# EasyEDA Pro project ProPrj_OpenCartGBA_2024-06-17.epro

# Schematic FRAM Save
Create Date: 2022-08-30; Page Name: P1; Project Name: OpenCartGBA; Schematic Name: FRAM Save; Update Date: 2022-09-11; Company: oshwhub.com/laqieer/opencartgba; Drawed: laqieer; Page Size: A4; Reviewed: laqieer; Version: 1
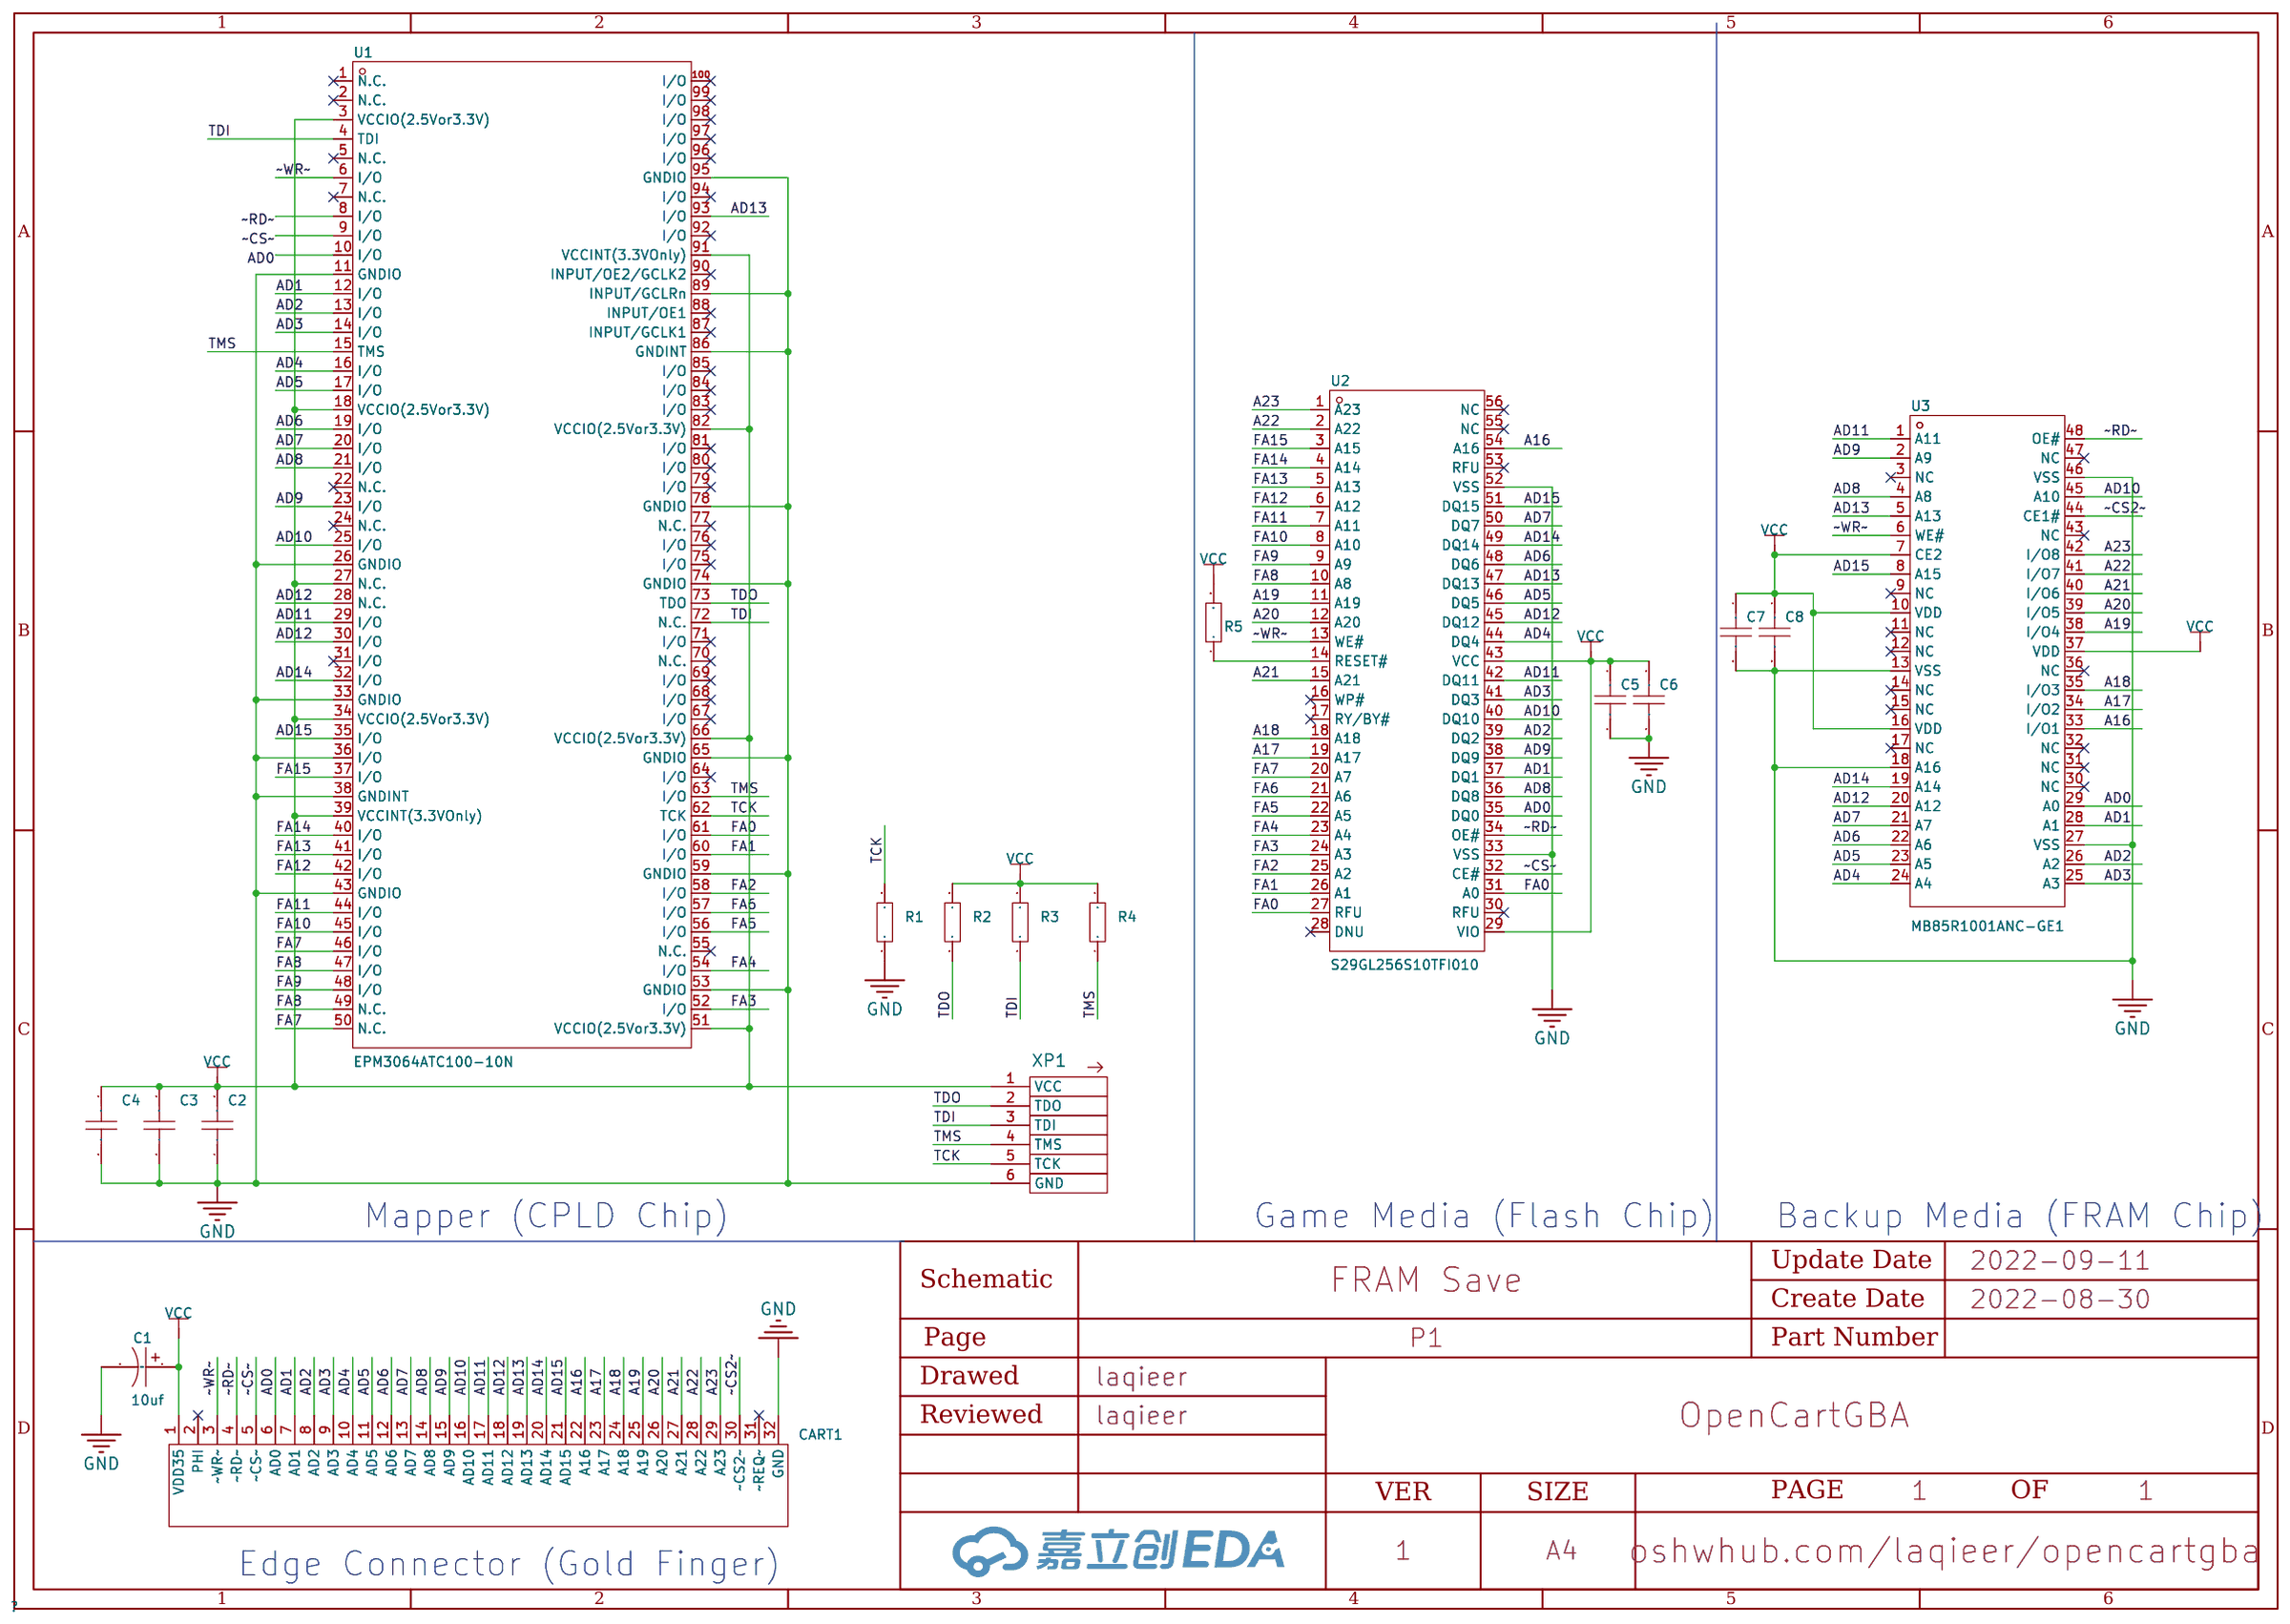
[diagram p0: schematic sheet]

## Parts
C1  10uf  [CAP-SMD_L2.0-W1.3-FD]
C2  100nF/0603/50V  [C0603]
C3  100nF/0603/50V  [C0603]
C4  100nF/0603/50V  [C0603]
C5  100nF/0603/50V  [C0603]
C6  100nF/0603/50V  [C0603]
C7  100nF/0603/50V  [C0603]
C8  100nF/0603/50V  [C0603]
CART1  -  [GBACartridge]  (no BOM)
R1  10kΩ  [R0603]
R2  10kΩ  [R0603]
R3  10kΩ  [R0603]
R4  10kΩ  [R0603]
R5  10kΩ  [R0603]
U1  EPM3064ATC100-10N  [TQFP-100_L14.0-W14.0-P0.50-LS16.0-BL]
U2  S29GL256S10TFI010  [TSOP-56_L18.4-W14.0-P0.50-LS20.0-TL]
U3  MB85R1001ANC-GE1  [TSOP-48_L12.4-W12.2-P0.50-LS14.0-BL]
XP1  JTAG  [JTAG_5P-P2.54]  (no BOM)

## Library data of the parts
C1 = 10uf: Supplier Part: C9900016685; Supplier Footprint: SMD,2x1.25x1.2mm; JLCPCB Part Class: Extended Part; Datasheet: https://atta.szlcsc.comnull; Supplier: LCSC
C2-C8 = 100nF/0603/50V: Supplier Part: C9900013340; JLCPCB Part Class: Extended Part; Datasheet: https://atta.szlcsc.comnull; Supplier: LCSC
CART1 = GBACartridge: GBA Cartridge
R1-R5 = 10kω: 电阻类型:薄膜电阻;阻值:10kΩ;精度:±0.1%;功率:100mW;温度系数:±25ppm/;最大工作电压:75V;工作温度范围:-55~+155;; LCSC Part Name: 10kΩ ±0.1% 100mW; Supplier Part: C188363; Manufacturer: EVER OHMS(天二科技); Manufacturer Part: TR0603B10K0P0525Z; Supplier Footprint: 0603; JLCPCB Part Class: Extended Part; Datasheet: https://atta.szlcsc.com/upload/public/pdf/source/20190415/C188363_433BF05B6FB8F7A0F5F35A3E4390C55A.pdf; Supplier: LCSC; Type: 薄膜电阻; Tolerance: ±0.1%; Power(Watts): 100mW; Temperature Coefficient: ±25ppm/; Overload Voltage (Max): 75V; Operating Temperature Range: -55~+155
U1 = EPM3064ATC100-10N: 可编程类型:-;逻辑元件/块数:-;宏单元数:-;I/O 数:-;工作温度:-;; Supplier Part: C34245; Manufacturer: Intel/Altera; Supplier Footprint: TQFP-100_14x14x05P; JLCPCB Part Class: Extended Part; Datasheet: https://atta.szlcsc.com/upload/public/pdf/source/20140723/1457707156998.pdf; Supplier: LCSC
U2 = S29GL256S10TFI010: Supplier Part: C1350995; Manufacturer: SPANSION(飞索); Supplier Footprint: TSOP-56; JLCPCB Part Class: Extended Part; Datasheet: https://atta.szlcsc.com/upload/public/pdf/source/20201109/C914940_4A5E28132C9BE0EE19A790F58F84C86D.pdf; Supplier: LCSC
U3 = MB85R1001ANC-GE1: 存储器容量:1Mb (128K x 8);存储器接口类型:Parallel;工作电压:3V ~ 3.6V;; Supplier Part: C126736; Manufacturer: FUJITSU(富士通); Supplier Footprint: TSOP-48; JLCPCB Part Class: Extended Part; Datasheet: https://atta.szlcsc.com/upload/public/pdf/source/20170821/C126736_1503303359319901614.pdf; Supplier: LCSC; Memory Format: FRAM; Memory Size: 1Mb (128K x 8); Memory Interface: Parallel; Voltage - Supply: 3V ~ 3.6V
XP1 = jtag

## Nets
GND: C1.2 C2.1 C3.2 C4.2 C5.2 C6.2 C7.2 C8.2 CART1.32(GND) R1.1 U1.11(GNDIO) U1.26(GNDIO) U1.33(GNDIO) U1.36(I/O) U1.38(GNDINT) U1.43(GNDIO) U1.53(GNDIO) U1.59(GNDIO) U1.65(GNDIO) U1.74(GNDIO) U1.78(GNDIO) U1.86(GNDINT) U1.89(INPUT/GCLRn) U1.95(GNDIO) U2.33(VSS) U2.52(VSS) U3.13(VSS) U3.18(A16) U3.27(VSS) U3.46(VSS) XP1.6(GND)
VCC: C1.1 C2.2 C3.1 C4.1 C5.1 C6.1 C7.1 C8.1 CART1.1(VDD35) R2.2 R3.2 R4.2 R5.2 U1.3(VCCIO(2.5Vor3.3V)) U1.18(VCCIO(2.5Vor3.3V)) U1.27(N.C.) U1.34(VCCIO(2.5Vor3.3V)) U1.39(VCCINT(3.3VOnly)) U1.51(VCCIO(2.5Vor3.3V)) U1.66(VCCIO(2.5Vor3.3V)) U1.82(VCCIO(2.5Vor3.3V)) U1.91(VCCINT(3.3VOnly)) U2.29(VIO) U2.43(VCC) U3.7(CE2) U3.10(VDD) U3.16(VDD) U3.37(VDD) XP1.1(VCC)
A16: CART1.22(A16) U2.54(A16) U3.33(I/O1)
A17: CART1.23(A17) U2.19(A17) U3.34(I/O2)
A18: CART1.24(A18) U2.18(A18) U3.35(I/O3)
A19: CART1.25(A19) U2.11(A19) U3.38(I/O4)
A20: CART1.26(A20) U2.12(A20) U3.39(I/O5)
A21: CART1.27(A21) U2.15(A21) U3.40(I/O6)
A22: CART1.28(A22) U2.2(A22) U3.41(I/O7)
A23: CART1.29(A23) U2.1(A23) U3.42(I/O8)
AD0: CART1.6(AD0) U1.10(I/O) U2.35(DQ0) U3.29(A0)
AD1: CART1.7(AD1) U1.12(I/O) U2.37(DQ1) U3.28(A1)
AD2: CART1.8(AD2) U1.13(I/O) U2.39(DQ2) U3.26(A2)
AD3: CART1.9(AD3) U1.14(I/O) U2.41(DQ3) U3.25(A3)
AD4: CART1.10(AD4) U1.16(I/O) U2.44(DQ4) U3.24(A4)
AD5: CART1.11(AD5) U1.17(I/O) U2.46(DQ5) U3.23(A5)
AD6: CART1.12(AD6) U1.19(I/O) U2.48(DQ6) U3.22(A6)
AD7: CART1.13(AD7) U1.20(I/O) U2.50(DQ7) U3.21(A7)
AD8: CART1.14(AD8) U1.21(I/O) U2.36(DQ8) U3.4(A8)
AD9: CART1.15(AD9) U1.23(I/O) U2.38(DQ9) U3.2(A9)
AD10: CART1.16(AD10) U1.25(I/O) U2.40(DQ10) U3.45(A10)
AD11: CART1.17(AD11) U1.29(I/O) U2.42(DQ11) U3.1(A11)
AD12: CART1.18(AD12) U1.28(N.C.) U1.30(I/O) U2.45(DQ12) U3.20(A12)
AD13: CART1.19(AD13) U1.93(I/O) U2.47(DQ13) U3.5(A13)
AD14: CART1.20(AD14) U1.32(I/O) U2.49(DQ14) U3.19(A14)
AD15: CART1.21(AD15) U1.35(I/O) U2.51(DQ15) U3.8(A15)
FA0: U1.61(I/O) U2.27(RFU) U2.31(A0)
FA1: U1.60(I/O) U2.26(A1)
FA2: U1.58(I/O) U2.25(A2)
FA3: U1.52(I/O) U2.24(A3)
FA4: U1.54(I/O) U2.23(A4)
FA5: U1.56(I/O) U2.22(A5)
FA6: U1.57(I/O) U2.21(A6)
FA7: U1.46(I/O) U1.50(N.C.) U2.20(A7)
FA8: U1.47(I/O) U1.49(N.C.) U2.10(A8)
FA9: U1.48(I/O) U2.9(A9)
FA10: U1.45(I/O) U2.8(A10)
FA11: U1.44(I/O) U2.7(A11)
FA12: U1.42(I/O) U2.6(A12)
FA13: U1.41(I/O) U2.5(A13)
FA14: U1.40(I/O) U2.4(A14)
FA15: U1.37(I/O) U2.3(A15)
TCK: R1.2 U1.62(TCK) XP1.5(TCK)
TDI: R3.1 U1.4(TDI) U1.72(N.C.) XP1.3(TDI)
TDO: R2.1 U1.73(TDO) XP1.2(TDO)
TMS: R4.1 U1.15(TMS) U1.63(I/O) XP1.4(TMS)
~CS2~: CART1.30(~CS2~) U3.44(CE1#)
~CS~: CART1.5(~CS~) U1.9(I/O) U2.32(CE#)
~RD~: CART1.4(~RD~) U1.8(I/O) U2.34(OE#) U3.48(OE#)
~WR~: CART1.3(~WR~) U1.6(I/O) U2.13(WE#) U3.6(WE#)
$1N60766: R5.1 U2.14(RESET#)

Not connected (* = marked no-connect by the designer): CART1 2(PHI)* 31(~REQ~)*; U1 1(N.C.)* 2(N.C.)* 5(N.C.)* 7(N.C.)* 22(N.C.)* 24(N.C.)* 31(I/O)* 55(N.C.)* 64(I/O)* 67(I/O)* 68(I/O)* 69(I/O)* 70(N.C.)* 71(I/O)* 75(I/O)* 76(I/O)* 77(N.C.)* 79(I/O)* 80(I/O)* 81(I/O)* 83(I/O)* 84(I/O)* 85(I/O)* 87(INPUT/GCLK1)* 88(INPUT/OE1)* 90(INPUT/OE2/GCLK2)* 92(I/O)* 94(I/O)* 96(I/O)* 97(I/O)* 98(I/O)* 99(I/O)* 100(I/O)*; U2 16(WP#)* 17(RY/BY#)* 28(DNU)* 30(RFU)* 53(RFU)* 55(NC)* 56(NC)*; U3 3(NC)* 9(NC)* 11(NC)* 12(NC)* 14(NC)* 15(NC)* 17(NC)* 30(NC)* 31(NC)* 32(NC)* 36(NC)* 43(NC)* 47(NC)*

## Notes on the sheet
- Mapper (CPLD Chip)
- Game Media (Flash Chip)
- Backup Media (FRAM Chip)
- Edge Connector (Gold Finger)

# Board PCB1
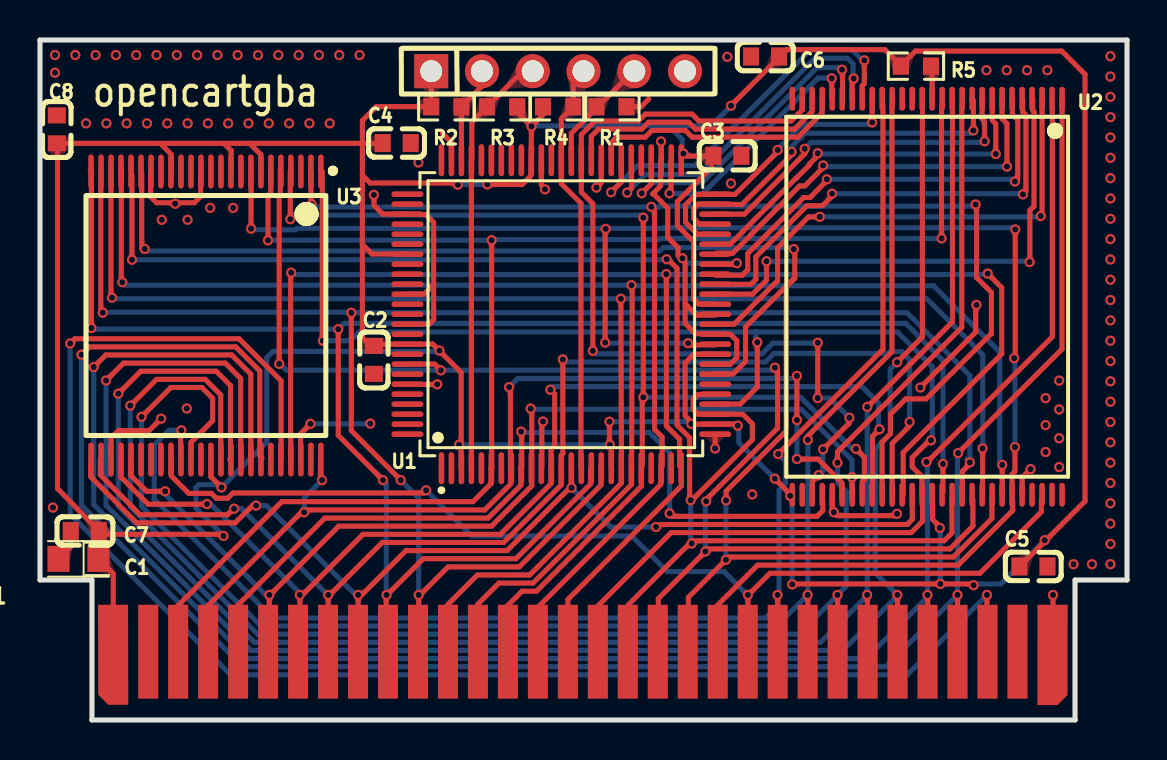
[diagram p1: board, top side]
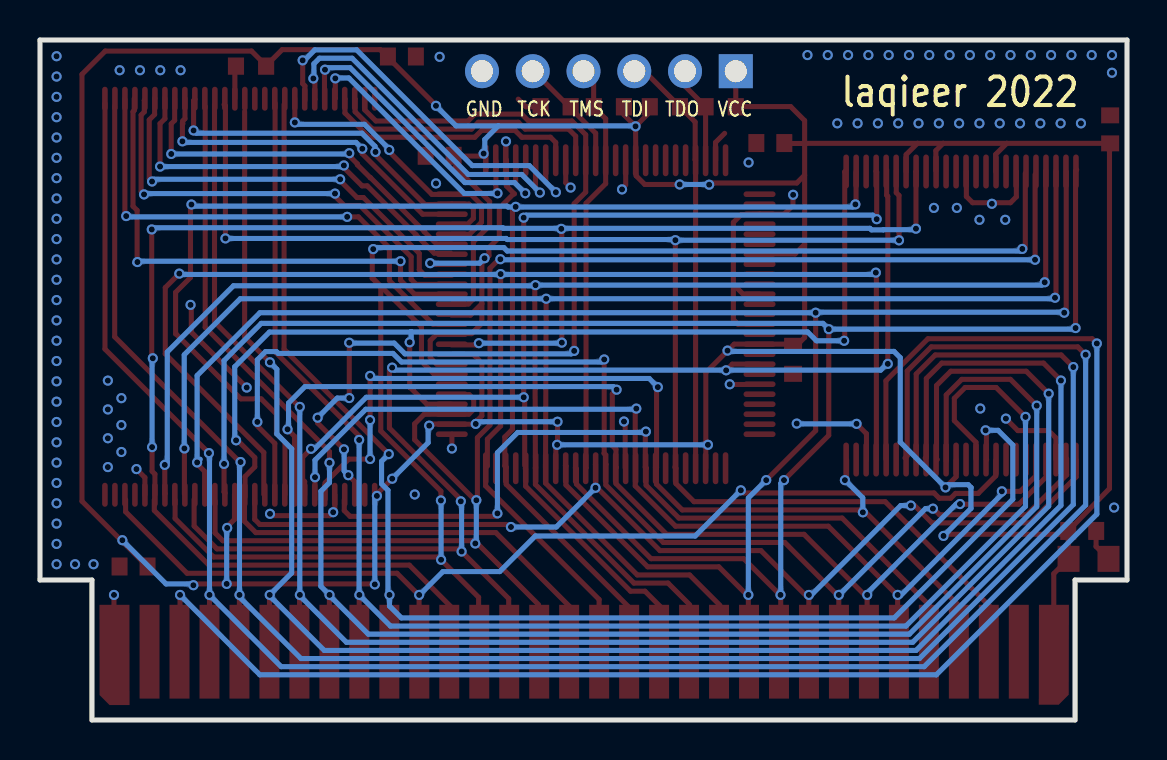
[diagram p2: board, bottom side, seen from below]

Outline 54.4 x 34 mm; copper layers: Top Layer, Bottom Layer. Coordinates in mm from the lower left corner of the outline.
Outline path: 0,34 0,7 2.6,7 2.6,0 51.8,0 51.8,7 54.4,7 54.4,34 0,34
Stack: Top Layer 0.035mm / Dielectric1 0.71mm FR4 er 4.5 / Bottom Layer 0.035mm

## Design rules (mm)
spacing safeClearance (default): track to track 0.152, other pairs 0 to 0.305
track width trackWidth (default): min 0.127, default 0.254, max 2.54
differential pair differentialPair (default): width min 0.127, default 0.254, max 2.54; gap min 0.152, default 0.152
via viaSize (default): diameter min 0.5, default 0.61, max 10; hole min 0.3, default 0.305, max 6

## Placement (name value [footprint] x y rotation side)
C1  10uf  [CAP-SMD_L2.0-W1.3-FD]  1.93 8.06 180 top
C2  100nF/0603/50V  [C0603]  16.71 18.01 90 top
C3  100nF/0603/50V  [C0603]  34.4 28.21 0 top
C4  100nF/0603/50V  [C0603]  17.85 28.85 0 top
C5  100nF/0603/50V  [C0603]  49.72 7.67 0 top
C6  100nF/0603/50V  [C0603]  36.29 33.17 180 top
C7  100nF/0603/50V  [C0603]  2.24 9.45 180 top
C8  100nF/0603/50V  [C0603]  0.84 29.53 90 top
CART1  -  [GBACartridge]  27.14 18.22 0 top
R1  10kΩ  [R0603]  28.6 30.66 180 top
R2  10kΩ  [R0603]  20.33 30.66 180 top
R3  10kΩ  [R0603]  23.13 30.66 0 top
R4  10kΩ  [R0603]  25.93 30.66 180 top
R5  10kΩ  [R0603]  43.84 32.69 180 top
U1  EPM3064ATC100-10N  [TQFP-100_L14.0-W14.0-P0.50-LS16.0-BL]  26.09 20.29 0 top
U2  S29GL256S10TFI010  [TSOP-56_L18.4-W14.0-P0.50-LS20.0-TL]  44.4 21.16 270 top
U3  MB85R1001ANC-GE1  [TSOP-48_L12.4-W12.2-P0.50-LS14.0-BL]  8.31 20.22 180 top
XP1  JTAG  [JTAG_5P-P2.54]  24.66 32.44 0 top

## Footprints (pads in the part's own frame, mm; a bottom-side part is the same pattern mirrored in y, then rotated)
C0603
  rect 0.8x0.9 smd: 1(-0.7,0) 2(0.7,0)
CAP-SMD_L2.0-W1.3-FD
  rect 1.1x1.3 smd: 1(-1,0) 2(1,0)
GBACartridge
  custom 1.509x4.995 smd: 1(-23.479,-14.958)
  custom 1x4.691 smd: 2(-21.724,-14.806) 3(-20.224,-14.806) 4(-18.724,-14.806) 5(-17.224,-14.806) 6(-15.725,-14.806) 7(-14.225,-14.806) 8(-12.725,-14.806) 9(-11.225,-14.806) 10(-9.725,-14.806) 11(-8.225,-14.806) 12(-6.724,-14.806) 13(-5.224,-14.806) 14(-3.724,-14.806) 15(-2.224,-14.806) 16(-0.725,-14.806) 17(0.775,-14.806) 18(2.276,-14.806) 19(3.776,-14.806) 20(5.276,-14.806) 21(6.776,-14.806) 22(8.275,-14.806) 23(9.775,-14.806) 24(11.275,-14.806) 25(12.775,-14.806) 26(14.275,-14.806) 27(15.775,-14.806) 28(17.276,-14.806) 29(18.776,-14.806) 30(20.276,-14.806) 31(21.776,-14.806)
  custom 1.506x5.012 smd: 32(23.529,-14.966)
JTAG_5P-P2.54
  rect 1.7x1.7 hole 1.1: 1(-5.08,0)
  round 1.7 hole 1.1: 2(-2.54,0) 3(0,0) 4(2.54,0) 5(5.08,0) 6(7.62,0)
R0603
  rect 0.807x0.864 smd: 1(-0.754,0) 2(0.754,0)
TQFP-100_L14.0-W14.0-P0.50-LS16.0-BL
  oval 0.28x1.6 smd: 1(-6,-7.7) 2(-5.5,-7.7) 3(-5,-7.7) 4(-4.5,-7.7) 5(-4,-7.7) 6(-3.5,-7.7) 7(-3,-7.7) 8(-2.5,-7.7) 9(-2,-7.7) 10(-1.5,-7.7) 11(-1,-7.7) 12(-0.5,-7.7) 13(0,-7.7) 14(0.5,-7.7) 15(1,-7.7) 16(1.5,-7.7) 17(2,-7.7) 18(2.5,-7.7) 19(3,-7.7) 20(3.5,-7.7) 21(4,-7.7) 22(4.5,-7.7) 23(5,-7.7) 24(5.5,-7.7) 25(6,-7.7) 51(6,7.7) 52(5.5,7.7) 53(5,7.7) 54(4.5,7.7) 55(4,7.7) 56(3.5,7.7) 57(3,7.7) 58(2.5,7.7) 59(2,7.7) 60(1.5,7.7) 61(1,7.7) 62(0.5,7.7) 63(0,7.7) 64(-0.5,7.7) 65(-1,7.7) 66(-1.5,7.7) 67(-2,7.7) 68(-2.5,7.7) 69(-3,7.7) 70(-3.5,7.7) 71(-4,7.7) 72(-4.5,7.7) 73(-5,7.7) 74(-5.5,7.7) 75(-6,7.7)
  oval 1.6x0.28 smd: 26(7.7,-6) 27(7.7,-5.5) 28(7.7,-5) 29(7.7,-4.5) 30(7.7,-4) 31(7.7,-3.5) 32(7.7,-3) 33(7.7,-2.5) 34(7.7,-2) 35(7.7,-1.5) 36(7.7,-1) 37(7.7,-0.5) 38(7.7,0) 39(7.7,0.5) 40(7.7,1) 41(7.7,1.5) 42(7.7,2) 43(7.7,2.5) 44(7.7,3) 45(7.7,3.5) 46(7.7,4) 47(7.7,4.5) 48(7.7,5) 49(7.7,5.5) 50(7.7,6) 76(-7.7,6) 77(-7.7,5.5) 78(-7.7,5) 79(-7.7,4.5) 80(-7.7,4) 81(-7.7,3.5) 82(-7.7,3) 83(-7.7,2.5) 84(-7.7,2) 85(-7.7,1.5) 86(-7.7,1) 87(-7.7,0.5) 88(-7.7,0) 89(-7.7,-0.5) 90(-7.7,-1) 91(-7.7,-1.5) 92(-7.7,-2) 93(-7.7,-2.5) 94(-7.7,-3) 95(-7.7,-3.5) 96(-7.7,-4) 97(-7.7,-4.5) 98(-7.7,-5) 99(-7.7,-5.5) 100(-7.7,-6)
TSOP-48_L12.4-W12.2-P0.50-LS14.0-BL
  oval 0.28x1.7 smd: 1(-5.75,-7.201) 2(-5.25,-7.201) 3(-4.75,-7.201) 4(-4.25,-7.201) 5(-3.749,-7.201) 6(-3.248,-7.201) 7(-2.751,-7.201) 8(-2.251,-7.201) 9(-1.75,-7.201) 10(-1.25,-7.201) 11(-0.75,-7.201) 12(-0.249,-7.201) 13(0.249,-7.201) 14(0.75,-7.201) 15(1.25,-7.201) 16(1.75,-7.201) 17(2.251,-7.201) 18(2.751,-7.201) 19(3.251,-7.201) 20(3.749,-7.201) 21(4.25,-7.201) 22(4.75,-7.201) 23(5.25,-7.201) 24(5.75,-7.201) 25(5.75,7.201) 26(5.25,7.201) 27(4.75,7.201) 28(4.25,7.201) 29(3.749,7.201) 30(3.251,7.201) 31(2.751,7.201) 32(2.251,7.201) 33(1.75,7.201) 34(1.25,7.201) 35(0.75,7.201) 36(0.249,7.201) 37(-0.249,7.201) 38(-0.75,7.201) 39(-1.25,7.201) 40(-1.75,7.201) 41(-2.251,7.201) 42(-2.751,7.201) 43(-3.248,7.201) 44(-3.749,7.201) 45(-4.25,7.201) 46(-4.75,7.201) 47(-5.25,7.201) 48(-5.75,7.201)
TSOP-56_L18.4-W14.0-P0.50-LS20.0-TL
  oval 1.199x0.28 smd: 1(-9.901,6.752) 2(-9.901,6.251) 3(-9.901,5.75) 4(-9.901,5.25) 5(-9.901,4.75) 6(-9.901,4.25) 7(-9.901,3.749) 8(-9.901,3.251) 9(-9.901,2.751) 10(-9.901,2.251) 11(-9.901,1.75) 12(-9.901,1.25) 13(-9.901,0.75) 14(-9.901,0.249) 15(-9.901,-0.249) 16(-9.901,-0.75) 17(-9.901,-1.25) 18(-9.901,-1.75) 19(-9.901,-2.251) 20(-9.901,-2.751) 21(-9.901,-3.248) 22(-9.901,-3.749) 23(-9.901,-4.25) 24(-9.901,-4.75) 25(-9.901,-5.25) 26(-9.901,-5.75) 27(-9.901,-6.251) 28(-9.901,-6.749) 29(9.901,-6.749) 30(9.901,-6.251) 31(9.901,-5.75) 32(9.901,-5.25) 33(9.901,-4.75) 34(9.901,-4.25) 35(9.901,-3.749) 36(9.901,-3.248) 37(9.901,-2.751) 38(9.901,-2.251) 39(9.901,-1.75) 40(9.901,-1.25) 41(9.901,-0.75) 42(9.901,-0.249) 43(9.901,0.249) 44(9.901,0.75) 45(9.901,1.25) 46(9.901,1.75) 47(9.901,2.251) 48(9.901,2.751) 49(9.901,3.251) 50(9.901,3.749) 51(9.901,4.25) 52(9.901,4.75) 53(9.901,5.25) 54(9.901,5.75) 55(9.901,6.251) 56(9.901,6.752)

## Nets
As in the schematic.

Pads without a net: CART1 2 31; U1 1 2 5 7 22 24 31 55 64 67 68 69 70 71 75 76 77 79 80 81 83 84 85 87 88 90 92 94 96 97 98 99 100; U2 16 17 28 30 53 55 56; U3 3 9 11 12 14 15 17 30 31 32 36 43 47

## Via types
v1: diameter 0.508, hole 0.305, Top Layer to Bottom Layer, 251 vias

## Routing (per net, layer and track width the routed paths; a pad name or vN(x,y) marks a point on that pad's centre or on a via; arc(x,y) is an arc through that point)
GND: length 68
  Top Layer w0.254: 25.09,28 25.09,26.75 ; 19.7,21.78 19.7,20.02 19.47,19.79 18.37,19.79 ; 19.7,21.78 19.7,24.88 19.31,25.27 18.37,25.3 ; 19.7,21.78 19.22,21.3 18.4,21.3 ; 25.11,12.61 25.11,14.9 25.12,14.91 ; 32.29,20.81 32.86,20.24 33.8,20.24 ; 32.29,20.81 32.29,19.83 32.8,19.32 33.82,19.32 33.85,19.29 ; 32.29,20.81 32.29,22.87 31.93,23.22 31.93,23.62 31.41,24.14 31.41,25.59 30.7,26.31 30.66,26.31 31.06,26.7 31.06,28.01 ; 28.09,27.98 28.09,26.86 v1(27.85,26.62) ; R1.1 30.08,30.66 30.47,31.04 ; 34.54,19.3 34.87,18.97 34.87,18.12 34.55,17.79 33.78,17.79 ; 33.79,14.29 v1(33.79,13.57) ; 39.64,11.26 39.64,10.42 ; 0.93,8.05 1.55,8.67 1.55,9.46 ; v1(42.89,10.31) 42.8,10.22 39.9,10.22 v1(39.73,10.39) 39.67,10.45 ; 49.15,11.27 49.15,12.12 v1(49.57,12.55) ; 18.37,25.3 17.15,25.3 16.72,25.73 16.72,26.25 ; 18.37,25.3 18.39,25.3 ; 18.4,16.78 19.87,16.78 v1(19.88,16.79) ; v1(44.06,16.62) 46.83,19.39 46.83,20.6 ; v1(13.54,14.81) 13.04,14.31 13.04,13.01 ; v1(50.7,6.25) 50.7,5.68 50.68,5.66 ; 3.56,13.04 3.56,14.11 3.93,14.47 5.46,14.47 v1(6.06,15.07) ; 8.04,27.43 8.04,26.18 7.73,25.86 5.83,25.86 5.54,26.16 5.54,27.44 ; 20.14,29.33 20.59,28.88 20.59,27.99 ; v1(34.87,22.84) 34.81,22.78 33.8,22.78
  Bottom Layer w0.254: v1(19.88,16.79) 19.88,16.77 19.87,16.76 ; v1(34.87,22.84) 32.4,22.84 v1(32.15,23.09) ; v1(13.54,14.81) 16.52,14.81 v1(16.53,14.82)
  vias: v1(0.65,10.62) v1(0.75,33.25) v1(0.75,32.36) v1(1.77,33.25) v1(2.31,29.83) v1(2.78,33.25) v1(3.32,29.83) v1(3.8,33.25) v1(4.34,29.83) v1(4.82,33.25) v1(5.36,29.83) v1(5.83,33.25) v1(6.1,25.01) v1(6.37,29.83) v1(6.85,33.25) v1(6.76,25.81) v1(7.35,15.57) v1(7.39,29.83) v1(7.39,25.01) v1(7.86,33.25) v1(8.4,29.83) v1(8.52,25.61) v1(8.88,33.25) v1(9.42,29.83) v1(9.66,25.61) v1(9.9,33.25) v1(10.44,29.83) v1(10.91,33.25) v1(11.45,29.83) v1(11.93,33.25) v1(12.47,29.83) v1(12.94,33.25) v1(13.48,29.83) v1(13.96,33.25) v1(14.5,29.83) v1(14.98,33.25) v1(15.99,33.25) v1(16.71,26.26) v1(18.94,27.88) v1(25.17,14.92) v1(25.27,26.53) v1(31.08,28.93) v1(34.4,33.16) v1(34.58,26.83) v1(35.65,11.28) v1(46.86,20.76) v1(47.36,32.49) v1(48.38,32.49) v1(49.4,32.49) v1(50.33,16.09) v1(50.33,14.75) v1(50.33,13.4) v1(50.41,32.49) v1(51,16.97) v1(51,15.53) v1(51,14.09) v1(51,12.65) v1(51.72,7.79) v1(52.64,7.79) v1(53.57,33.19) v1(53.57,32.17) v1(53.57,31.16) v1(53.57,30.14) v1(53.57,29.12) v1(53.57,28.11) v1(53.57,27.09) v1(53.57,26.08) v1(53.57,25.06) v1(53.57,24.04) v1(53.57,23.03) v1(53.57,22.01) v1(53.57,21) v1(53.57,19.98) v1(53.57,18.96) v1(53.57,17.95) v1(53.57,16.93) v1(53.57,15.92) v1(53.57,14.9) v1(53.57,13.88) v1(53.57,12.87) v1(53.57,11.85) v1(53.57,10.84) v1(53.57,9.82) v1(53.57,8.8) v1(53.57,7.79)
VCC: length 235.9
  Top Layer w0.254: 6.57,27.43 6.57,28.28 6.02,28.83 ; 34.99,14.8 33.8,14.8 ; 8.55,13 8.55,12.16 v1(9.08,11.63) ; 16.13,23.78 16.13,19.12 16.46,18.8 ; 16.13,23.78 16.62,23.3 18.4,23.3 ; 16.13,23.78 16.13,27.24 ; 33.61,28.2 32.32,28.2 v1(32.2,28.32) ; 33.8,20.8 32.96,20.8 32.71,21.05 32.71,23.91 31.9,24.72 31.9,25.92 33.63,27.65 ; 18.36,18.79 16.69,18.79 16.68,18.8 ; 16.07,28.83 16.06,28.83 10.49,28.83 ; 19.58,30.67 16.83,30.67 16.13,29.97 16.13,28.84 ; 19.58,30.67 R2.2 ; 19.58,30.67 XP1.1 ; 19.58,30.67 19.59,30.67 ; 2.98,9.41 0.88,11.57 0.88,28.83 ; 2.98,9.41 C7.1 2.94,8.07 C1.1 3.67,7.32 3.67,3.45 ; 2.98,9.41 3.11,9.29 9.1,9.29 v1(9.19,9.2) ; 0.86,28.83 6.02,28.83 ; 6.02,28.83 9.2,28.83 ; 10.49,28.83 11.05,28.27 11.05,27.41 ; 10.49,28.83 9.2,28.83 ; v1(34.58,30.71) 34.58,30.73 37.37,33.52 42.28,33.52 43.07,32.72 43.07,32.66 ; 9.57,27.46 9.57,28.47 9.2,28.83 ; 16.13,27.24 16.13,28.79 ; 16.13,27.24 16.53,26.85 20.83,26.85 v1(20.91,26.77) ; v1(37.64,6.78) 37.67,6.8 v1(45.06,6.8) 46.66,6.8 v1(46.72,6.74) ; 24.58,28 24.58,28.02 24.56,27.21 24.13,26.78 v1(22.39,26.78) ; 24.58,28 v1(24.6,29.68) ; 24.58,28 24.58,27.98 ; 18.43,18.79 19.66,18.79 21.08,17.37 21.08,12.6 ; v1(28.5,14.92) 28.5,13.78 v1(28.52,13.76) 28.59,13.69 28.59,12.57 ; v1(45.03,9.6) 45.03,9.67 44.67,10.03 44.67,11.28 ; v1(24.6,29.68) 25.17,30.26 25.17,30.65 ; v1(24.6,29.68) 23.89,30.39 23.89,30.66 ; 37.54,11.17 37.54,11.3 v1(36.77,12.06) ; 32.09,28.23 32.15,28.29 ; 33.79,18.28 32.72,18.28 32.29,17.85 32.29,15.21 32.71,14.79 33.73,14.79 ; 16.1,28.83 17.13,28.83 ; 49.14,7.79 52.3,10.94 52.3,32.28 51.13,33.45 43.81,33.45 43.08,32.72
  Bottom Layer w0.254: 46.71,6.8 48.09,6.8 v1(50.28,8.99) ; v1(28.5,14.92) 32.48,14.92 v1(32.59,14.8) ; v1(19.99,18.47) 19.95,18.43 11.66,18.43 11.35,18.12 11.35,13.89 v1(9.08,11.63) 8.95,11.77 7.95,11.77 7.81,11.62 7.81,11.62 7.81,10.58 v1(9.19,9.2) ; 34.97,14.81 34.97,13.86 v1(36.77,12.06) ; v1(24.6,29.68) 24.6,29.71 31.46,29.71 ; v1(20.91,26.77) 20.92,26.78 v1(22.39,26.78) ; 32.14,28.21 32.14,29.03 31.46,29.71 ; v1(37.64,6.78) 37.64,11.22 37.63,11.22 ; v1(20.97,13.76) v1(28.52,13.76) ; 31.46,29.71 33.58,29.71 v1(34.58,30.71) ; v1(45.06,6.8) 45.06,9.53
  vias: v1(34.92,14.72) v1(37.54,11.21)
A16: length 50.1
  Top Layer w0.254: 35.43,6.23 36.53,7.34 47.04,7.34 50.11,10.41 50.11,11.02 ; 35.43,6.23 35.42,6.23 ; 35.43,6.23 35.43,5.59 ; 35.43,6.23 35.43,6.25 v1(35.42,6.25) ; 6.57,12.99 6.57,12.21 7.44,11.33 8.58,11.33 8.82,11.09 9.4,11.09 9.66,11.35 19.19,11.35 v1(19.33,11.48)
  Bottom Layer w0.254: 35.42,6.23 34.23,7.42 31.39,7.42 29.61,9.2 21.61,9.2 v1(19.33,11.48)
A17: length 68.3
  Top Layer w0.254: v1(7.08,14.48) 7.04,14.44 7.04,13.03 7.03,13.02 ; 36.92,5.32 36.92,6.24 v1(36.91,6.25) ; v1(36.94,13.3) 42.18,18.54 42.18,30.78
  Bottom Layer w0.254: v1(7.08,14.48) 6.45,14.48 5.72,13.75 5.72,11.04 11.65,5.1 36.31,5.1 36.91,5.7 v1(36.91,6.25) 36.99,6.33 36.99,11.49 37.31,11.81 37.31,12.93 v1(36.94,13.3)
A18: length 76
  Top Layer w0.254: 42.63,30.85 42.63,18.41 38.43,14.2 v1(38.43,14) ; 7.56,13.05 7.56,13.88 8.64,14.97 8.64,16.09 8.1,16.63 6.55,16.63 v1(5.08,15.16) ; 38.42,5.41 38.42,6.25 v1(38.42,6.25)
  Bottom Layer w0.254: v1(5.08,15.16) 5.08,10.68 11.06,4.7 36.86,4.7 v1(38.42,6.25) 38.43,6.27 v1(38.43,14)
A19: length 80.8
  Top Layer w0.254: 9.05,12.95 9.05,16.25 8.27,17.03 5.83,17.03 v1(4.52,15.72) ; 46.13,30.68 46.13,19.63 39.91,13.41 v1(39.91,12.86) ; 39.92,5.41 39.92,6.25 v1(39.91,6.25)
  Bottom Layer w0.254: v1(4.52,15.72) 4.52,10.67 10.89,4.29 37.97,4.29 39.91,6.23 v1(39.91,6.25) 40.34,6.69 40.34,11.44 39.91,11.87 v1(39.91,12.86)
A20: length 84.2
  Top Layer w0.254: v1(41.39,6.25) 41.41,6.24 41.41,5.39 ; 45.67,30.78 45.67,19.9 41.42,15.66 v1(41.4,15.66) ; 9.5,13.02 9.54,13.06 9.54,16.72 8.82,17.44 5.04,17.44 v1(3.92,16.32)
  Bottom Layer w0.254: 41.4,15.69 41.4,6.26 v1(41.39,6.25) 41.39,6.22 39.06,3.89 10.73,3.89 3.92,10.69 v1(3.92,16.32)
A21: length 87.8
  Top Layer w0.254: 10.1,13.1 10.05,13.16 10.05,17.07 9.27,17.84 4.18,17.84 v1(3.31,16.97) ; 42.91,5.46 42.91,6.24 v1(42.9,6.25) ; 44.16,30.44 44.16,19.15 v1(42.89,17.89)
  Bottom Layer w0.254: v1(42.89,17.89) 42.54,17.54 42.54,14.3 41.8,13.56 41.8,7.35 v1(42.9,6.25) 42.9,6.21 40.17,3.48 10.56,3.48 3.31,10.73 v1(3.31,16.97)
A22: length 93.7
  Top Layer w0.254: 10.55,13.21 10.55,17.3 9.6,18.25 3.29,18.25 v1(2.69,17.65) ; 50.66,30.67 50.66,19.16 44.4,12.9 v1(44.36,12.9) ; 44.42,5.41 44.42,6.25 v1(44.42,6.25)
  Bottom Layer w0.254: v1(2.69,17.65) 2.69,10.77 10.39,3.07 41.34,3.07 44.42,6.15 v1(44.42,6.25) 44.42,12.85 v1(44.36,12.9)
A23: length 97.6
  Top Layer w0.254: v1(45.92,6.25) 45.92,5.57 45.91,5.57 ; v1(2.07,18.27) 2.47,18.66 9.79,18.66 11,17.45 11,13.21 11.11,13.1 ; 51.15,30.82 51.15,18.55 v1(45.95,13.35)
  Bottom Layer w0.254: v1(45.95,13.35) 45.92,13.32 v1(45.92,6.25) 42.33,2.67 10.15,2.67 2.07,10.74 v1(2.07,18.27)
AD0: length 49.1
  Top Layer w0.254: 40.64,11.02 40.64,11.94 ; 11.48,5.64 11.48,5.64 v1(11.48,6.25) ; 4.54,13.07 4.54,12.23 5.34,11.43 v1(6.26,11.43) ; 11.51,6.25 14.95,9.69 22.59,9.69 24.61,11.71 24.61,15.52 v1(24.56,15.57)
  Bottom Layer w0.254: v1(24.56,15.57) 24.59,15.54 38.09,15.54 40.64,13 v1(40.64,12.14) ; 11.48,6.21 11.34,6.21 6.26,11.29 v1(6.26,11.43)
AD1: length 54.6
  Top Layer w0.254: 41.66,11.02 41.66,14.19 v1(42.01,14.53) ; 25.58,12.63 25.58,11.82 23.04,9.28 16.16,9.28 13.08,6.2 ; 25.58,12.63 25.58,12.64 ; 25.58,12.63 25.59,12.64 ; 25.58,12.64 25.58,13.53 ; 25.58,12.64 25.59,12.64 ; v1(25.54,16.52) 25.76,16.3 25.76,13.72 25.57,13.53 ; 25.59,12.64 25.6,12.65 ; 13.01,5.64 13.01,6.25 v1(13,6.25) ; v1(8.36,10.8) 8.35,10.79 5.41,10.79 4.04,12.16 4.04,13.04
  Bottom Layer w0.254: 13,6.21 13,6.35 8.55,10.8 v1(8.36,10.8) ; 25.55,16.51 25.7,16.67 41.14,16.67 41.96,15.85 41.96,14.58 v1(42.01,14.53)
AD2: length 60.1
  Top Layer w0.254: 9.73,10.54 9.66,10.54 9.38,10.26 5.01,10.26 3.02,12.26 3.02,13.07 ; 26.08,12.78 26.08,12.78 26.08,11.75 23.21,8.88 17.13,8.88 14.49,6.24 ; v1(26.16,18.03) 26.16,13.34 26.18,13.33 ; 43.52,14.7 42.65,13.83 42.65,11.03 ; 14.42,5.61 14.42,5.62 v1(14.42,6.25)
  Bottom Layer w0.254: v1(9.71,10.57) 10.09,10.57 14.42,6.23 ; v1(26.16,18.03) 26.29,17.9 36.3,17.9 36.73,18.33 42.48,18.33 42.57,18.42 43.11,18.42 43.52,18.01 v1(43.52,14.9)
AD3: length 50.7
  Top Layer w0.254: 43.65,11.03 43.65,10.03 43.4,9.78 31.05,9.78 ; v1(15.92,6.25) 15.92,6.25 15.92,5.63 ; v1(10.82,10.72) 10.63,10.72 9.77,9.86 4.84,9.86 2.55,12.15 2.55,12.99 ; 16.02,6.17 18.32,8.47 23.38,8.47 26.6,11.69 26.6,12.76 26.61,12.77
  Bottom Layer w0.254: v1(26.6,11.61) 28.56,9.65 v1(30.83,9.65) ; v1(10.82,10.72) 11.33,10.72 15.87,6.18 15.92,6.18
AD4: length 86.5
  Top Layer w0.254: 27.61,12.61 27.55,12.55 27.55,11.8 23.82,8.06 19.18,8.06 17.33,6.22 ; 17.32,6.2 17.33,6.22 ; 17.33,6.22 17.33,5.51 ; 17.33,6.22 17.33,6.24 v1(17.34,6.25) ; v1(17.17,11.99) 14.93,14.23 v1(14.93,19.54) ; v1(2.58,19.6) 2.58,27.46 2.52,27.51 ; 45.13,11.34 45.19,11.4 v1(45.19,12.8)
  Bottom Layer w0.254: 17.34,6.29 17.33,6.3 17.33,11.83 v1(17.17,11.99) ; v1(2.58,19.6) 2.63,19.54 v1(14.93,19.54) 15.22,19.83 43.33,19.83 45.19,17.97 v1(45.19,12.8)
AD5: length 86.8
  Top Layer w0.254: 18.96,6.19 20.43,7.66 23.99,7.66 28.08,11.75 28.08,12.7 28.11,12.73 ; 46.12,11.23 46.16,11.27 46.16,12.43 46.54,12.8 v1(46.54,12.88) ; 18.95,6.25 18.95,5.61 ; v1(3.14,20.37) 3.04,20.46 3.04,27.43 ; v1(15.58,20.37) 15.58,14.47 v1(18.06,11.99)
  Bottom Layer w0.254: v1(18.06,11.99) 18.95,11.1 18.95,6.22 ; 3.09,20.39 15.56,20.39 v1(15.58,20.37) 43.39,20.37 46.54,17.22 v1(46.54,12.88) 46.38,13.04
  vias: v1(18.95,6.25)
AD6: length 78.8
  Top Layer w0.254: 29.1,12.6 29.1,12.79 29.1,12.8 ; 29.1,12.6 29.1,11.85 24.51,7.25 21.89,7.25 20.37,5.73 ; 29.1,12.6 v1(29.07,21.06) ; 3.56,27.43 3.56,21.16 v1(3.61,21.11) ; 47.17,11.28 v1(47.17,13.58)
  Bottom Layer w0.254: v1(47.17,13.58) 47.18,13.59 47.18,18.26 44.38,21.06 v1(29.07,21.06) 3.66,21.06 3.58,21.14
AD7: length 78.4
  Top Layer w0.254: 29.61,12.57 29.64,21.71 v1(29.6,21.74) ; 29.61,12.57 29.61,11.78 24.67,6.85 22.97,6.85 21.88,5.76 ; 29.61,12.57 29.61,12.6 29.59,12.62 ; v1(4.12,21.89) 4.12,22.04 4.07,22.09 4.07,27.48 ; v1(48.16,12.76) 48.16,11.32 48.14,11.31
  Bottom Layer w0.254: v1(48.16,12.76) 48.03,12.88 48.03,18.4 44.72,21.71 29.63,21.71 v1(29.6,21.74) 4.26,21.74 v1(4.12,21.89)
AD8: length 56.8
  Top Layer w0.254: 12.57,27.44 12.53,27.4 v1(12.53,25.04) ; 30.11,12.56 30.1,12.55 30.1,11.69 24.84,6.44 24.12,6.44 23.35,5.66 ; 41.15,11.26 41.15,11.92 41.26,12.02 ; v1(30.19,25.12) 30.19,25.11 v1(30.19,16.14) ; v1(40.84,13.56) 41.26,13.14 41.26,12.02 ; 30.14,12.73 30.14,15.99
  Bottom Layer w0.254: v1(30.19,25.12) 30.07,25.24 12.73,25.24 v1(12.53,25.04) ; v1(30.19,16.14) 38.07,16.14 40.65,13.56 v1(40.84,13.56)
AD9: length 75.6
  Top Layer w0.254: 13.56,27.42 13.56,25.81 v1(13.59,25.78) ; 31.07,12.64 31.07,11.79 24.88,5.59 ; 31.07,12.64 31.14,12.7 31.14,14.15 30.76,14.53 30.76,25.5 v1(30.6,25.66) ; 31.07,12.64 31.07,12.64 ; v1(46.82,25.77) 46.87,25.73 46.87,22.13 47.61,21.38 47.61,19.31 47.6,19.31 44.35,16.06 43.33,16.06 42.57,15.3 42.57,14.32 42.14,13.9 42.14,11.27
  Bottom Layer w0.254: v1(46.82,25.77) 46.74,25.69 31.02,25.69 30.98,25.65 13.73,25.65 v1(13.59,25.78)
AD10: length 77.1
  Top Layer w0.254: v1(47.43,22.32) 48.13,21.62 48.13,18.31 43.2,13.38 43.2,11.28 ; v1(12.57,22.37) 12.54,22.34 12.54,13.04 ; v1(31.35,22.3) 31.35,14.7 32.01,14.04 32.01,12.71 32.1,12.62 32.1,11.71 26.42,6.03 26.42,5.5
  Bottom Layer w0.254: v1(12.57,22.37) 12.66,22.28 47.38,22.28 v1(47.43,22.32)
AD11: length 71.7
  Top Layer w0.254: 35.92,18.92 35.9,18.91 35.9,16.65 35.04,15.79 33.81,15.79 ; 44.62,14.1 43.65,13.12 43.65,12.66 44.14,12.17 44.14,11.14 ; 27.82,5.6 31.59,9.37 43.6,9.37 44.16,9.94 44.16,11.06 ; v1(14.16,18.96) 14.13,18.99 14.13,27.41 14.04,27.5
  Bottom Layer w0.254: 35.82,19.42 35.8,19.4 15.98,19.4 15.55,18.96 v1(14.16,18.96) ; 35.82,19.42 35.85,19.4 42.92,19.4 44.65,17.66 44.65,14.05 v1(44.59,13.98) ; 35.82,19.42 35.82,18.96
  vias: v1(35.9,18.89)
AD12: length 75.3
  Top Layer w0.254: v1(31.36,23.04) 31.43,23.04 31.88,22.59 31.88,14.75 32.51,14.12 32.51,11.04 v1(32.56,10.99) 32.63,10.99 35.65,14.01 35.65,14.81 35.17,15.28 33.76,15.29 ; 33.76,15.29 33.79,15.29 ; 33.76,15.29 32.94,15.29 32.69,15.54 32.69,16.04 32.92,16.27 33.8,16.27 ; 4.6,23.01 4.6,27.28 ; 29.45,5.77 32.64,8.96 45.25,8.96 45.64,9.35 45.64,10.96 ; 32.58,10.86 32.58,10.93
  Bottom Layer w0.254: 4.64,23.01 31.33,23.01 v1(31.36,23.04) ; v1(32.56,10.99) 32.56,8.88 v1(32.62,8.83)
  vias: v1(4.6,23.01)
AD13: length 66.2
  Top Layer w0.254: v1(20.06,17.48) 19.75,17.79 18.4,17.79 ; 30.94,5.55 30.94,6.07 v1(33.3,8.43) ; v1(36.78,17.62) 36.91,17.48 36.91,14.59 33.34,11.02 v1(33.34,10.93) ; v1(11.97,17.81) 11.97,26.18 12.03,26.24 12.03,27.52 ; 46.69,11.03 46.69,9.7 45.54,8.56 33.38,8.56
  Bottom Layer w0.254: v1(36.78,17.62) 36.65,17.49 12.33,17.49 11.99,17.83 v1(11.97,17.81) ; v1(33.3,8.43) 33.3,10.89 v1(33.34,10.93)
AD14: length 78.9
  Top Layer w0.254: 32.45,5.61 32.45,6.13 v1(34.33,8.01) 34.46,8.15 45.71,8.15 47.64,10.08 47.64,11 ; 37.77,22.08 37.77,23.65 ; 37.77,22.08 37.34,21.66 37.34,14.45 34.34,11.44 v1(34.34,10.98) ; 37.77,22.08 37.74,22.08 35.31,19.65 35.31,17.93 34.69,17.3 33.78,17.3 ; 5.09,27.33 5.09,23.59 5.13,23.55 v1(5.24,23.55)
  Bottom Layer w0.254: v1(5.24,23.55) 5.34,23.45 31.02,23.45 31.19,23.62 37.65,23.62 v1(37.72,23.54) ; v1(34.33,8.01) 34.33,10.97 v1(34.34,10.98)
AD15: length 83.4
  Top Layer w0.254: U2.51 48.65,12.29 48.79,12.43 v1(48.79,13.64) ; v1(48.81,24.53) 48.81,18.14 v1(48.75,18.09) ; 32.43,18.91 32.58,18.75 33.81,18.75 ; v1(10.56,24.57) 10.56,27.42 U3.8 ; 33.74,5.57 35.91,7.74 45.94,7.74 48.68,10.48 48.68,11.01 ; v1(28.28,18.87) 28.28,24.57
  Bottom Layer w0.254: v1(28.28,18.87) 28.31,18.84 v1(32.44,18.84) ; v1(10.56,24.57) 10.61,24.52 12.19,24.52 12.2,24.51 12.79,24.51 12.87,24.58 31.21,24.58 31.24,24.61 48.72,24.61 v1(48.81,24.53) ; v1(48.79,13.64) 48.79,18.05 v1(48.75,18.09)
  vias: v1(28.31,24.56)
FA0: length 44.3
  Top Layer w0.254: v1(38.92,18.86) 38.92,18.86 v1(38.92,16.1) ; U2.27 38.15,30.51 37.59,29.95 32.98,29.95 32.63,30.29 30.29,30.29 29.95,29.95 27.78,29.95 27.09,29.26 U1.61 27.09,26.39 27.67,25.82 v1(27.67,18.46) ; v1(38.97,12.24) 38.66,11.93 38.66,11.27 ; v1(39.19,13.53) 40.5,14.85 v1(40.5,15.11)
  Bottom Layer w0.254: v1(27.67,18.46) 27.82,18.31 36.14,18.31 36.67,18.84 38.91,18.84 v1(38.92,18.86) ; v1(40.5,15.11) 39.52,16.1 v1(38.92,16.1) ; v1(38.97,12.24) 39.18,12.45 39.18,13.49
FA1: length 13.7
  Top Layer w0.254: U2.26 38.63,31.05 38.63,30.42 37.76,29.54 32.81,29.54 32.46,29.89 30.46,29.89 30.12,29.54 27.95,29.54 27.59,29.19 U1.60
FA2: length 13
  Top Layer w0.254: U1.58 28.59,28.88 28.85,29.14 30.29,29.14 30.63,29.48 32.3,29.48 32.64,29.14 37.93,29.14 39.14,30.35 39.14,31.05 U2.25
FA3: length 13.3
  Top Layer w0.254: 31.51,26.34 v1(31.5,26.34) 31.53,26.34 ; 31.51,26.34 31.53,26.34 ; 31.51,26.34 31.58,26.41 ; 31.58,26.41 31.53,26.34 ; 31.58,26.41 31.58,27.94 ; v1(39.62,32.08) 39.62,31.09 39.63,31.08
  Bottom Layer w0.254: 39.61,32.1 38.94,32.1 33.17,26.33 31.52,26.33
FA4: length 16.1
  Top Layer w0.254: 30.6,27.99 30.6,26.82 v1(30.11,26.34) ; 40.16,30.91 40.16,32.49 v1(40.14,32.52)
  Bottom Layer w0.254: v1(40.14,32.52) 40.04,32.62 38.88,32.62 33.14,26.87 30.65,26.87 v1(30.11,26.34)
FA5: length 17.7
  Top Layer w0.254: v1(29.38,26.37) 29.6,26.59 29.6,27.99 ; 40.64,31.03 40.64,31.03 40.64,32 v1(40.72,32.08)
  Bottom Layer w0.254: v1(29.38,26.37) 30.29,27.28 32.97,27.28 38.78,33.09 40.41,33.09 40.69,32.81 40.69,32.1 v1(40.72,32.08)
FA6: length 19.6
  Top Layer w0.254: 41.25,32.98 41.25,31.82 41.14,31.7 41.14,30.99 ; v1(28.58,26.39) 29.09,26.9 29.09,28
  Bottom Layer w0.254: v1(28.58,26.39) 29.91,27.72 32.77,27.72 38.55,33.51 40.64,33.51 41.13,33.02
  vias: v1(41.25,32.98)
FA7: length 14.8
  Top Layer w0.254: 33.8,26.28 34.79,26.28 36.87,28.36 ; v1(41.65,29.88) 41.65,31.08 ; 33.8,24.29 32.91,24.29 32.3,24.89 32.3,25.76 32.82,26.27 33.79,26.27
  Bottom Layer w0.254: v1(41.65,29.88) 41.65,29.78 38.16,29.78 36.88,28.5
  vias: v1(36.92,28.5)
FA8: length 19
  Top Layer w0.254: 33.04,24.79 33.77,24.79 ; 33.8,25.8 33.79,25.8 ; 33.79,25.8 32.93,25.8 32.71,25.58 32.71,25.08 33.01,24.78 ; 33.79,25.8 35.12,25.77 37.67,28.32 37.68,28.32 ; v1(46.71,29.48) 46.71,30.97 46.64,31.04
  Bottom Layer w0.254: 37.63,28.49 37.63,28.69 38.29,29.34 46.57,29.34 v1(46.71,29.48)
  vias: v1(37.61,28.4)
FA9: length 17.3
  Top Layer w0.254: U1.48 35.25,25.29 38.28,28.32 38.28,28.41 ; 47.14,31.1 47.14,30.07 47.25,29.96 47.25,29.81 47.27,29.86 v1(47.27,28.93)
  Bottom Layer w0.254: v1(47.27,28.93) 47.22,28.88 38.59,28.88 v1(38.27,28.56)
FA10: length 18.9
  Top Layer w0.254: v1(38.92,28.34) 38.92,28.21 38.52,27.81 38.52,27.76 37.87,27.11 37.85,27.11 35.17,24.43 35.17,24.42 34.55,23.79 33.78,23.79 ; 47.66,31.07 47.66,29.98 47.83,29.81 v1(47.83,28.3)
  Bottom Layer w0.254: 38.92,28.32 38.95,28.3 47.83,28.3 v1(47.83,28.3)
FA11: length 20
  Top Layer w0.254: 48.15,31.1 48.15,30.07 48.39,29.82 v1(48.39,27.67) ; 39.29,27.72 38.28,26.71 38.02,26.71 35.58,24.26 35.58,24.25 34.67,23.34 33.85,23.34
  Bottom Layer w0.254: v1(48.39,27.67) 39.23,27.67 39.18,27.72
  vias: v1(39.19,27.73)
FA12: length 21.8
  Top Layer w0.254: 33.79,22.24 35.15,22.24 35.42,22.51 35.42,23.33 38.21,26.12 38.54,26.12 39.36,26.94 ; 48.65,31.1 48.66,31.08 48.66,30.28 48.93,30.01 48.93,27.07 v1(48.79,26.93)
  Bottom Layer w0.254: v1(48.79,26.93) 48.68,27.04 v1(39.38,27.04)
FA13: length 22.9
  Top Layer w0.254: v1(49.19,26.28) 49.34,26.43 49.34,30.25 49.18,30.41 49.18,30.98 49.16,31 ; v1(39.64,26.32) 39.64,26.19 39.16,25.72 38.38,25.72 35.82,23.16 35.82,22.03 35.58,21.78 33.8,21.78
  Bottom Layer w0.254: v1(39.64,26.32) 49.15,26.32 v1(49.19,26.28)
FA14: length 25.5
  Top Layer w0.254: 36.36,22.98 36.36,21.99 35.66,21.29 33.81,21.29 ; 49.68,31.07 49.68,30.48 49.74,30.42 49.74,25.69 49.54,25.48 49.54,22.85
  Bottom Layer w0.254: 49.66,22.85 49.57,22.94 v1(36.36,22.94)
  vias: v1(49.52,22.9)
FA15: length 25.4
  Top Layer w0.254: U1.37 34.73,19.79 36.91,21.97 36.91,23.61 38.46,25.16 v1(39.03,25.16) ; 50.15,31.05 50.15,25.26 v1(50.08,25.2)
  Bottom Layer w0.254: v1(39.03,25.16) 50.05,25.16 v1(50.08,25.2)
TCK: length 5.8
  Top Layer w0.254: U1.62 26.59,29.34 29.69,32.44 XP1.5
TDI: length 21.4
  Top Layer w0.254: XP1.3 24.15,32.44 R3.1 21.61,29.9 21.61,28.01 U1.72 21.59,12.63
TDO: length 4.9
  Top Layer w0.254: R2.1 22.12,31.69 XP1.2 ; U1.73 21.09,30.66
TMS: length 20.7
  Top Layer w0.254: U1.15 27.07,12.61 27.07,25.84 26.09,26.82 U1.63 26.09,30.06 26.69,30.66 26.69,31.93 XP1.4
~CS2~: length 75.5
  Top Layer w0.254: 12.07,13.04 12.07,16.96 9.96,19.06 1.75,19.06 v1(1.51,18.83) ; 47.35,5.58 47.39,5.62 v1(47.39,6.25)
  Bottom Layer w0.254: v1(47.39,6.25) 43.4,2.26 9.54,2.26 1.51,10.29 v1(1.51,18.83)
~CS~: length 38.6
  Top Layer w0.254: 24.07,12.59 24.07,12.59 24.08,12.6 ; 24.07,12.59 24.07,11.74 22.43,10.1 14.26,10.1 9.9,5.74 ; 24.07,12.59 24.08,12.6 ; v1(24.08,14.42) 24.11,14.39 24.11,12.63 24.08,12.6 ; 31.51,10.28 31.6,10.18 38.88,10.18 39.17,10.47 39.17,11.01
  Bottom Layer w0.254: v1(31.51,10.33) 31.51,13.36 30.49,14.38 24.12,14.38 v1(24.08,14.42)
~RD~: length 47.9
  Top Layer w0.254: v1(14.12,11.99) 14.04,12.08 14.04,13.03 ; v1(37.88,17.21) 37.88,15.05 37.88,15.05 ; v1(37.88,13.05) 37.89,13.04 38.94,13.04 40.13,11.86 40.13,11.03 ; v1(23.48,16.64) 23.54,16.58 23.54,12.62 23.56,12.6 ; 8.42,5.73 13.2,10.5 22.26,10.5 23.55,11.8 23.55,12.58 23.6,12.63
  Bottom Layer w0.254: 13.23,10.47 13.23,11.11 14.11,11.99 v1(14.12,11.99) ; 37.88,17.21 37.88,17.11 37.85,17.08 23.91,17.08 v1(23.48,16.64) ; v1(37.88,15) v1(37.88,13.05)
  vias: v1(13.22,10.38)
~WR~: length 74.5
  Top Layer w0.254: 45.19,30.77 45.12,30.71 v1(45.12,24.08) ; 22.63,12.64 22.58,12.59 22.58,11.82 21.67,10.92 12.1,10.92 6.84,5.66 ; v1(11.41,23.98) 11.41,26.23 11.55,26.37 11.55,27.48 ; 22.6,23.99 22.6,12.63
  Bottom Layer w0.254: v1(45.12,24.08) 45.12,24.08 31.07,24.08 31.02,24.02 22.64,24.02 v1(22.6,23.99) 11.42,23.99 v1(11.41,23.98)
$1N60766: length 1.7
  Top Layer w0.254: U2.14 44.65,32.64 R5.1

## Copper pours and planes (outline as drawn; the poured copper is in the pictures)
GND on Top Layer: -0.68,34.67 55.11,34.67 55.11,-0.69 -0.68,-0.69
GND on Bottom Layer: -1.1,35.09 55.65,35.09 55.65,-1.71 -1.1,-1.71

Small or netless copper shapes (teardrops, artwork), in the pictures only: 319 on Top Layer, 170 on Bottom Layer

## Text on the board
Bottom Silkscreen Layer: VCC | TDO | TDI | TMS | TCK | GND | laqieer 2022
Top Silkscreen Layer: opencartgba
